# EAGLE board ControlBoard (EAGLE 9.0.1)
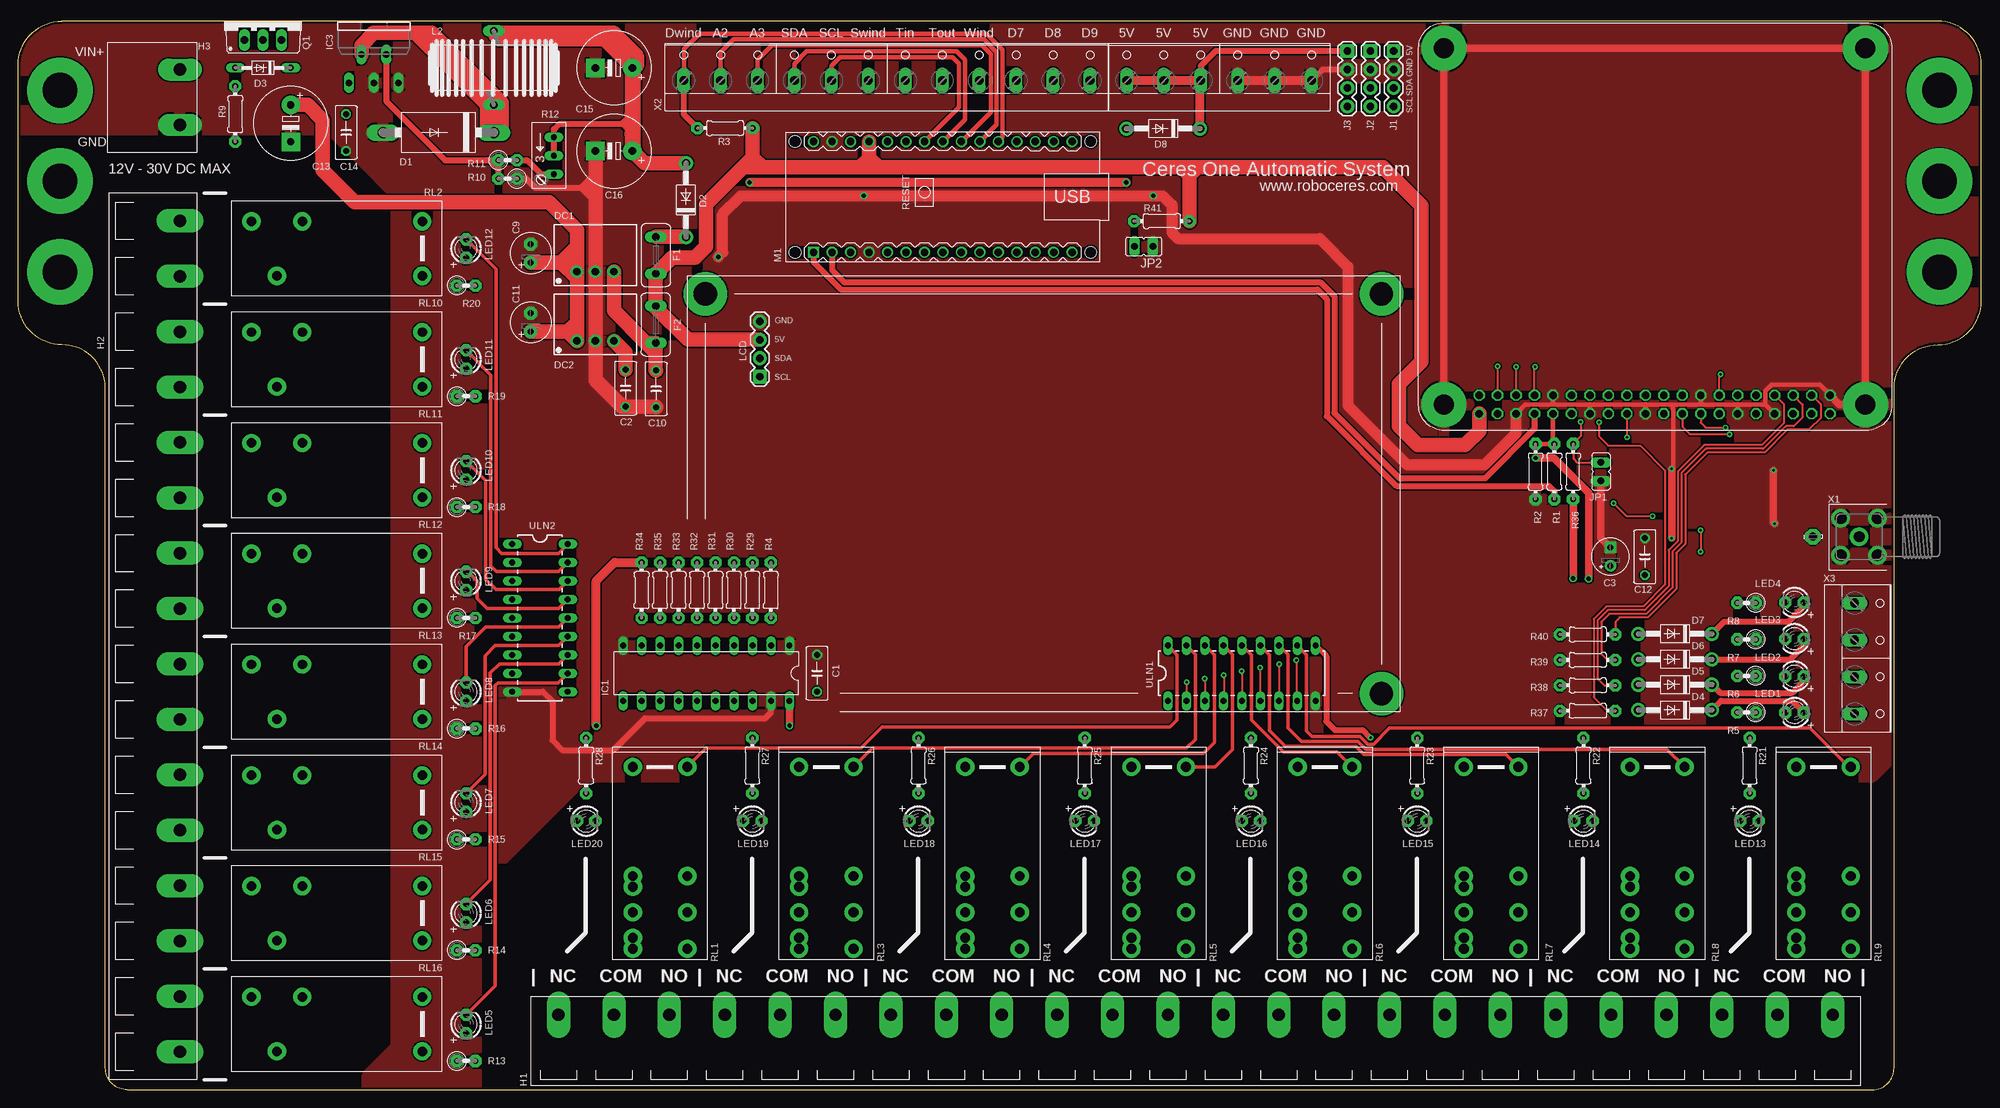
[diagram p1: board, top side]
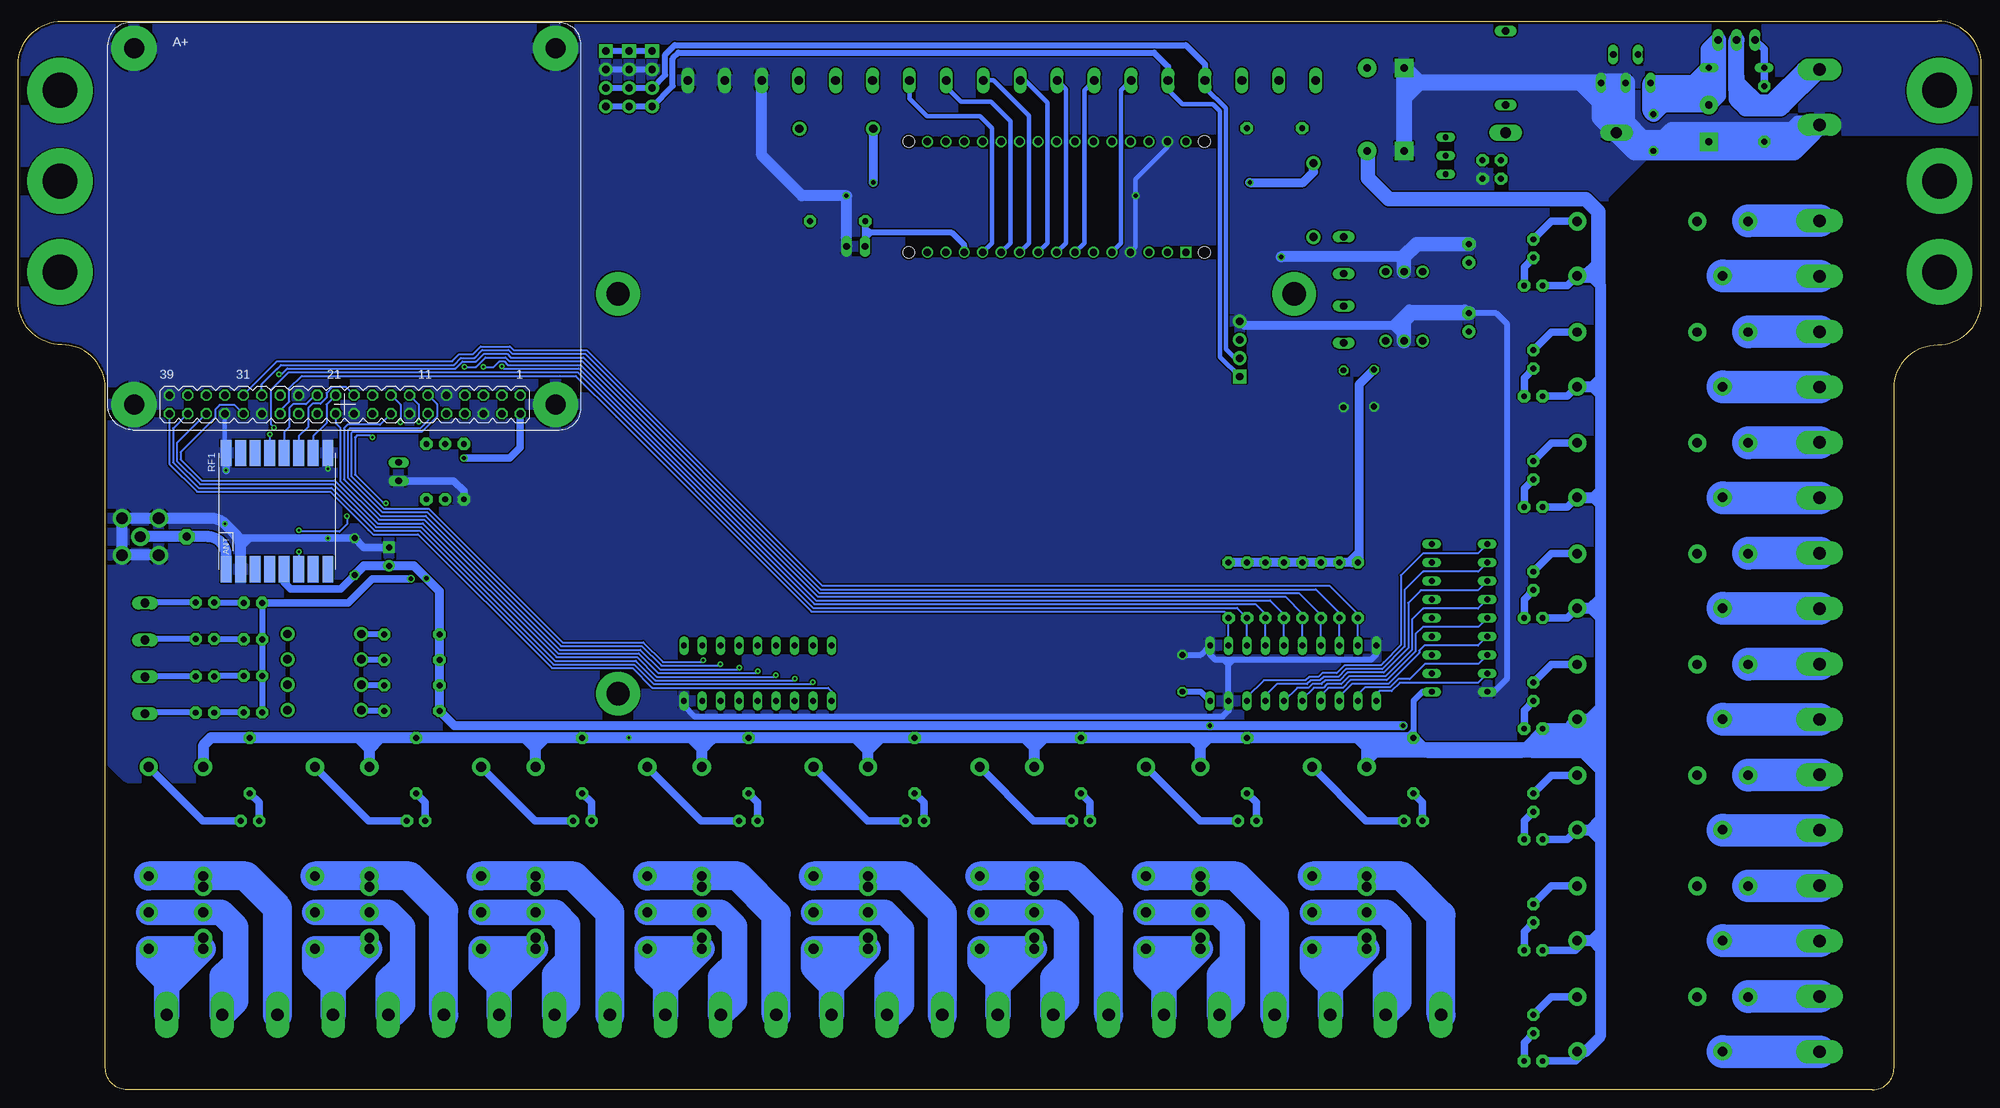
[diagram p2: board, bottom side, seen from below]

Size 270 x 147 mm. Coordinates in mm from the lower left corner, seen from the top.
Outline: 15,0 255,0 arc90 258,3 258,96.5 arc-90 264,102.5 arc90 270,108.5 270,141 arc90 264,147 6,147 arc90 0,141 0,108.5 arc90 6,102.5 arc-90 12,96.5 12,3 arc90 15,0
Copper layers (1*16): Top 0.035mm / dielectric 1.5mm / Bottom 0.035mm
Design rules "default *": minimum track width 6mil, minimum drill 0.35mm, track to track 8mil, track to pad 8mil, pad to pad 8mil, via to via 8mil, smd to smd 0mil, copper to edge 10mil, drill to drill 6mil, minimum pad ring 10mil, minimum via ring 8mil, stop-mask expansion 4mil, vias tented up to drill 0mil, thermal gap 10mil

## Footprints (pad centres in the part's own frame; a part is rotated, then mirrored left to right if it is on the bottom)
C050-030X075 = drill 0.813 octagon: 1 -2.54,0; 2 2.54,0
E2,5-5 = drill 0.813 pad 1.6: + -1.27,0 | drill 0.813 pad 1.6 square: - 1.27,0
E2,5-6 = drill 0.813 pad 1.778: + -1.27,0 | drill 0.813 pad 1.778 octagon: - 1.27,0
E5-10,5 = drill 1.016 pad 2.54: + -2.54,0 | drill 1.016 pad 2.54 square: - 2.54,0
DO201-15 = drill 1.499 long: A 7.62,0; C -7.62,0
DO41-10 = drill 1.118 pad 1.93: A 5.08,0; C -5.08,0
DO34Z7 = drill 0.813 long: A 3.81,0; C -3.81,0
SIP3 = drill 1 pad 1.676: 1 -2.54,0; 2 0,0; 3 2.54,0
TE5 = drill 1.016 long: 1 -2.54,0; 2 2.54,0
24/7.62CONN = drill 1.7 pad 3.2 long: 1 -87.63,3.81; 2 -80.01,3.81; 3 -72.39,3.81; 4 -64.77,3.81; 5 -57.15,3.81; 6 -49.53,3.81; 7 -41.91,3.81; 8 -34.29,3.81; 9 -26.67,3.81; 10 -19.05,3.81; 11 -11.43,3.81; 12 -3.81,3.81; 13 3.81,3.81; 14 11.43,3.81; 15 19.05,3.81; 16 26.67,3.81; 17 34.29,3.81; 18 41.91,3.81; 19 49.53,3.81; 20 57.15,3.81; 21 64.77,3.81; 22 72.39,3.81; 23 80.01,3.81; 24 87.63,3.81
16/7.62CONN = drill 1.7 pad 3.2 long: 1 -57.15,3.81; 2 -49.53,3.81; 3 -41.91,3.81; 4 -34.29,3.81; 5 -26.67,3.81; 6 -19.05,3.81; 7 -11.43,3.81; 8 -3.81,3.81; 9 3.81,3.81; 10 11.43,3.81; 11 19.05,3.81; 12 26.67,3.81; 13 34.29,3.81; 14 41.91,3.81; 15 49.53,3.81; 16 57.15,3.81
2/7.62CONN = drill 1.7 pad 3 long: P$1 -3.81,0; P$2 3.81,0
DIL20 = drill 0.813 long: 1 -11.43,-3.81; 2 -8.89,-3.81; 3 -6.35,-3.81; 4 -3.81,-3.81; 5 -1.27,-3.81; 6 1.27,-3.81; 7 3.81,-3.81; 8 6.35,-3.81; 9 8.89,-3.81; 10 11.43,-3.81; 11 11.43,3.81; 12 8.89,3.81; 13 6.35,3.81; 14 3.81,3.81; 15 1.27,3.81; 16 -1.27,3.81; 17 -3.81,3.81; 18 -6.35,3.81; 19 -8.89,3.81; 20 -11.43,3.81
TO220-5 = drill 0.9 long: 1 -3.4,-8.4; 2 -1.7,-4.5; 3 0,-8.4; 4 1.7,-4.5; 5 3.4,-8.4
1X04 = drill 1.016 pad 1.88 square: 1 0,0 | drill 1.016 pad 1.88: 2 2.54,0; 3 5.08,0; 4 7.62,0
JP1 = drill 0.914 long: 1 0,-1.27; 2 0,1.27
SFT830D = drill 1.016 long: 1 -5.08,0; 2 5.08,0
LED3MM = drill 0.813 pad 1.676 octagon: A -1.27,0; K 1.27,0
LSP11 = drill 1.118 pad 2.159 octagon: MP 0,0
ARDUINO-NANO-3.0 = drill 1 square: J1.1 17.78,7.62 | drill 1: J1.2 15.24,7.62; J1.3 12.7,7.62; J1.4 10.16,7.62; J1.5 7.62,7.62; J1.6 5.08,7.62; J1.7 2.54,7.62; J1.8 0,7.62; J1.9 -2.54,7.62; J1.10 -5.08,7.62; J1.11 -7.62,7.62; J1.12 -10.16,7.62; J1.13 -12.7,7.62; J1.14 -15.24,7.62; J1.15 -17.78,7.62; J2.1 17.78,-7.62; J2.2 15.24,-7.62; J2.3 12.7,-7.62; J2.4 10.16,-7.62; J2.5 7.62,-7.62; J2.6 5.08,-7.62; J2.7 2.54,-7.62; J2.8 0,-7.62; J2.9 -2.54,-7.62; J2.10 -5.08,-7.62; J2.11 -7.62,-7.62; J2.12 -10.16,-7.62; J2.13 -12.7,-7.62; J2.14 -15.24,-7.62; J2.15 -17.78,-7.62 | hole 1.651: -20.32,7.62; -20.32,-7.62; 20.32,-7.62; 20.32,7.62
RASPBERRY_PI_B+ = drill 1.016 octagon: 1 8.37,51.23; 2 8.37,53.77; 3 10.91,51.23; 4 10.91,53.77; 5 13.45,51.23; 6 13.45,53.77; 7 15.99,51.23; 8 15.99,53.77; 9 18.53,51.23; 10 18.53,53.77; 11 21.07,51.23; 12 21.07,53.77; 13 23.61,51.23; 14 23.61,53.77; 15 26.15,51.23; 16 26.15,53.77; 17 28.69,51.23; 18 28.69,53.77; 19 31.23,51.23; 20 31.23,53.77; 21 33.77,51.23; 22 33.77,53.77; 23 36.31,51.23; 24 36.31,53.77; 25 38.85,51.23; 26 38.85,53.77; 27 41.39,51.23; 28 41.39,53.77; 29 43.93,51.23; 30 43.93,53.77; 31 46.47,51.23; 32 46.47,53.77; 33 49.01,51.23; 34 49.01,53.77; 35 51.55,51.23; 36 51.55,53.77; 37 54.09,51.23; 38 54.09,53.77; 39 56.63,51.23; 40 56.63,53.77 | drill 2.75 pad 6.2: PE_BL 3.5,3.5; PE_BR 61.5,3.5; PE_TL 3.5,52.5; PE_TR 61.5,52.5
TO220BV = drill 1.016 long: D 0,-2.54; G -2.54,-2.54; S 2.54,-2.54
0204/7 = drill 0.813 pad 1.676 octagon: 1 -3.81,0; 2 3.81,0
0207/2V = drill 0.813 pad 1.676 octagon: 1 -1.27,0; 2 1.27,0
RJ9W = drill 0.813 long: A 2.54,0.635; E -2.54,0.635; S 0,0.635
RADIO_MODULE = smd 3.6 x 1.5: 3V3 8,1; ANT 8,-7; DIO0 8,3; DIO1 8,5; DIO2 8,7; DIO3 8,-3; DIO4 8,-1; DIO5 -8,-5; GND -8,-7; GND1 -8,7; GND2 8,-5; MISO -8,5; MOSI -8,3; NSS -8,-1; RESET -8,-3; SCK -8,1
DOUBLE_RELAY = drill 1.35 pad 2.5: COM1 7.5,3.75; COM2 7.5,-3.75; NC1 2.5,3.75; NC2 2.5,-3.75; NC3 4,-3.75; NO1 12.5,3.75; NO2 12.5,-3.75; NO3 11,-3.75; S+/R- -12.5,-3.75; S-/R+ -12.5,3.75
OMIH-SS-105LM,300 = drill 1.3 pad 2.5: C1 -11.75,3.75; C2 -11.75,-3.75; COM 8.25,3.75; NC 4.75,-3.75; NO 11.75,-3.75
DIL18 = drill 0.813 long: 1 -10.16,-3.81; 2 -7.62,-3.81; 3 -5.08,-3.81; 4 -2.54,-3.81; 5 0,-3.81; 6 2.54,-3.81; 7 5.08,-3.81; 8 7.62,-3.81; 9 10.16,-3.81; 10 10.16,3.81; 11 7.62,3.81; 12 5.08,3.81; 13 2.54,3.81; 14 0,3.81; 15 -2.54,3.81; 16 -5.08,3.81; 17 -7.62,3.81; 18 -10.16,3.81
SMA90_DIP = drill 1.5 pad 2.54: ANTENNA 0,0 | drill 1.6 pad 2.54: GND1 -2.54,2.54; GND2 2.54,2.54; GND3 -2.54,-2.54; GND4 2.54,-2.54
W237-12P = drill 1.194 long: 1 -27.94,-0.635; 2 -22.86,-0.635; 3 -17.78,-0.635; 4 -12.7,-0.635; 5 -7.62,-0.635; 6 -2.54,-0.635; 7 2.54,-0.635; 8 7.62,-0.635; 9 12.7,-0.635; 10 17.78,-0.635; 11 22.86,-0.635; 12 27.94,-0.635
W237-4P = drill 1.194 long: 1 -7.62,-0.635; 2 -2.54,-0.635; 3 2.54,-0.635; 4 7.62,-0.635
W237-6P = drill 1.194 long: 1 -12.7,-0.635; 2 -7.62,-0.635; 3 -2.54,-0.635; 4 2.54,-0.635; 5 7.62,-0.635; 6 12.7,-0.635

## Placement (x,y rotation side)
C1  0.1u  [C050-030X075]  109.87,57.3 90 top
C2  0.1u  [C050-030X075]  83.53,96.51 270 top
C3  4.7u  [E2,5-5]  219,73.34 90 top
C9  22u  [E2,5-6]  70.5,115.08 90 top
C10  0.1u  [C050-030X075]  87.73,96.43 270 top
C11  22u  [E2,5-6]  70.5,105.56 90 top
C12  0.1u  [C050-030X075]  223.73,73.34 90 top
C13  100u/50  [E5-10,5]  37.48,132.96 270 top
C14  0.1u  [C050-030X075]  45.1,131.69 270 top
C15  470u/16  [E5-10,5]  81.93,140.58 180 top
C16  470u/16  [E5-10,5]  81.93,129.15 180 top
D1  1N5822  [DO201-15]  57.8,131.69 180 top
D2  1N4007  [DO41-10]  91.84,122.41 90 top
D3  10V  [DO34Z7]  33.67,140.58 180 top
D4  1N4007  [DO41-10]  227.88,52.23 180 top
D5  1N4007  [DO41-10]  227.88,55.73 180 top
D6  1N4007  [DO41-10]  227.88,59.23 180 top
D7  1N4007  [DO41-10]  227.88,62.73 180 top
D8  1N4007  [DO41-10]  157.48,132.23 180 top
DC1  TSR 1-2450  [SIP3]  79.39,112.55 0 top
DC2  R-78E3.3-0.5  [SIP3]  79.39,103.02 0 top
F1  [TE5]  87.7,114.81 270 top
F2  [TE5]  87.69,105.27 90 top
H1  24X1(0.300)CONN  [24/7.62CONN]  161.94,6.5 0 top
H2  16X1(0.300)CONN  [16/7.62CONN]  18.43,62.38 270 top
H3  2X1(0.300)CONN  [2/7.62CONN]  22.24,136.54 270 top
IC1  74HC540N  [DIL20]  94.63,57.3 180 top
IC3  LM2576T  [TO220-5]  48.91,146.93 0 top
J1  [1X04]  189.16,142.89 270 top
J2  [1X04]  185.99,142.89 270 top
J3  [1X04]  182.81,142.89 270 top
JP1  [JP1]  217.68,85.05 0 top
JP2  [JP1]  154.8,116 90 top
L2  7447070  [SFT830D]  65.42,140.58 90 top
LCD  [1X04]  102,98.11 90 top
LED1  [LED3MM]  244.31,51.88 180 top
LED2  [LED3MM]  244.31,56.88 180 top
LED3  [LED3MM]  244.31,62.03 180 top
LED4  [LED3MM]  244.31,67.03 180 top
LED5  [LED3MM]  61.61,9.04 90 top
LED6  [LED3MM]  61.61,24.28 90 top
LED7  [LED3MM]  61.61,39.52 90 top
LED8  [LED3MM]  61.61,54.76 90 top
LED9  [LED3MM]  61.61,70 90 top
LED10  [LED3MM]  61.61,85.24 90 top
LED11  [LED3MM]  61.61,100.48 90 top
LED12  [LED3MM]  61.61,115.72 90 top
LED13  [LED3MM]  238.14,36.98 0 top
LED14  [LED3MM]  215.28,36.98 0 top
LED15  [LED3MM]  192.42,36.98 0 top
LED16  [LED3MM]  169.56,36.98 0 top
LED17  [LED3MM]  146.7,36.98 0 top
LED18  [LED3MM]  123.84,36.98 0 top
LED19  [LED3MM]  100.98,36.98 0 top
LED20  [LED3MM]  78.12,36.98 0 top
LSP1  LSP11  [LSP11]  246.83,76.1 0 top
M1  ARDUINO-NANO-3.0  [ARDUINO-NANO-3.0]  127.18,122.83 180 top
PCB1  RASPBERRY_PI_B+  [RASPBERRY_PI_B+]  192.57,146.78 180 bottom
Q1  IRF9Z34NPBF  [TO220BV]  33.67,146.93 0 top
R1  [0204/7]  211.28,85.05 270 top
R2  [0204/7]  208.7,85.05 270 top
R3  [0204/7]  97.22,132.3 180 top
R4  [0204/7]  103.52,68.73 90 top
R5  [0207/2V]  237.7,51.93 180 top
R6  [0207/2V]  237.7,56.95 180 top
R7  [0207/2V]  237.7,61.97 180 top
R8  [0207/2V]  237.7,67 180 top
R9  10k  [0204/7]  29.86,134.23 90 top
R10  1k 1%  [0207/2V]  67.33,125.34 180 top
R11  3k 1%  [0207/2V]  67.33,127.88 0 top
R12  1k  [RJ9W]  73.04,128.51 270 top
R13  [0207/2V]  61.61,3.96 0 top
R14  [0207/2V]  61.61,19.2 0 top
R15  [0207/2V]  61.61,34.44 0 top
R16  [0207/2V]  61.61,49.68 0 top
R17  [0207/2V]  61.61,64.92 0 top
R18  [0207/2V]  61.61,80.16 0 top
R19  [0207/2V]  61.61,95.4 0 top
R20  [0207/2V]  61.61,110.64 0 top
R21  [0204/7]  238.14,44.6 270 top
R22  [0204/7]  215.28,44.6 270 top
R23  [0204/7]  192.42,44.6 270 top
R24  [0204/7]  169.56,44.6 270 top
R25  [0204/7]  146.7,44.6 270 top
R26  [0204/7]  123.84,44.6 270 top
R27  [0204/7]  100.98,44.6 270 top
R28  [0204/7]  78.12,44.6 270 top
R29  [0204/7]  100.98,68.73 90 top
R30  [0204/7]  98.44,68.73 90 top
R31  [0204/7]  95.9,68.73 90 top
R32  [0204/7]  93.36,68.73 90 top
R33  [0204/7]  90.82,68.73 90 top
R34  [0204/7]  85.74,68.73 90 top
R35  [0204/7]  88.28,68.73 90 top
R36  [0204/7]  213.86,85.05 270 top
R37  [0204/7]  215.87,52.14 180 top
R38  [0204/7]  215.87,55.64 180 top
R39  [0204/7]  215.87,59.14 180 top
R40  [0204/7]  215.87,62.64 180 top
R41  [0204/7]  157.3,119.5 0 top
RF1  HOPERF_RADIO  [RADIO_MODULE]  234.4,79.6 270 bottom
RL1  G5RLU1EDC5  [DOUBLE_RELAY]  88.28,31.9 270 top
RL2  OMIH-SS-105LM,300  [OMIH-SS-105LM,300]  43.83,115.72 180 top
RL3  G5RLU1EDC5  [DOUBLE_RELAY]  111.14,31.9 270 top
RL4  G5RLU1EDC5  [DOUBLE_RELAY]  134,31.9 270 top
RL5  G5RLU1EDC5  [DOUBLE_RELAY]  156.86,31.9 270 top
RL6  G5RLU1EDC5  [DOUBLE_RELAY]  179.72,31.9 270 top
RL7  G5RLU1EDC5  [DOUBLE_RELAY]  202.58,31.9 270 top
RL8  G5RLU1EDC5  [DOUBLE_RELAY]  225.44,31.9 270 top
RL9  G5RLU1EDC5  [DOUBLE_RELAY]  248.3,31.9 270 top
RL10  OMIH-SS-105LM,300  [OMIH-SS-105LM,300]  43.83,100.48 180 top
RL11  OMIH-SS-105LM,300  [OMIH-SS-105LM,300]  43.83,85.24 180 top
RL12  OMIH-SS-105LM,300  [OMIH-SS-105LM,300]  43.83,70 180 top
RL13  OMIH-SS-105LM,300  [OMIH-SS-105LM,300]  43.83,54.76 180 top
RL14  OMIH-SS-105LM,300  [OMIH-SS-105LM,300]  43.83,39.52 180 top
RL15  OMIH-SS-105LM,300  [OMIH-SS-105LM,300]  43.83,24.28 180 top
RL16  OMIH-SS-105LM,300  [OMIH-SS-105LM,300]  43.83,9.04 180 top
ULN1  ULN2803A  [DIL18]  168.29,57.3 0 top
ULN2  ULN2803A  [DIL18]  71.77,64.92 270 top
X1  [SMA90_DIP]  253.21,76.08 270 top
X2  [W237-12P]  119.47,139.49 0 top
X3  [W237-4P]  253.21,59.34 270 top
X4  [W237-6P]  165.19,139.49 0 top

## Tracks (layer width: path | path; a pad name or v marks a point on that pad's centre or on a via)
5VCC
  Top 0.813: J3.1 164.69,142.89 162.66,140.85 X4.3
  Top 1.27: X4.1 X4.2 X4.3 162.56,138.75 D8.C
  Bottom 0.813: J3.1 J2.1 J1.1
C1
  Bottom 0.305: IC1.2 R4.1 103.52,65.22 104.1,65.8 160.9,65.8 187.7,92.6 187.75,92.65 193.3,98.2 195.5,98.2 231,98.2 232.7,96.5 232.7,94.7 233.96,93.44 PCB1.28
C2  (via drill 0.35)
  Top 0.305: PCB1.26 231.42,91.78 232.1,91.1 v234.8,91.1
  Bottom 0.305: IC1.3 R29.1 102.37,66.31 160.69,66.31 193.09,98.71 195.8,98.71 232.79,98.71 235.2,96.3 235.2,91.5 v234.8,91.1
C3  (via drill 0.35)
  Top 0.305: PCB1.3 203.48,99.48 v203.5,99.5
  Bottom 0.305: IC1.4 98.44,64.5 R30.1 98.44,65.44 99.82,66.82 160.48,66.82 192.88,99.22 203.22,99.22 v203.5,99.5
C4  (via drill 0.35)
  Top 0.305: PCB1.5 206.02,99.42 v206,99.44
  Bottom 0.305: IC1.5 95.9,64.6 R31.1 95.9,65.4 97.82,67.32 160.27,67.32 192.67,99.72 202.69,99.72 203.2,100.23 203.8,100.23 204.6,99.44 v206,99.44
C5  (via drill 0.35)
  Top 0.305: PCB1.7 208.56,99.4 v208.6,99.44
  Bottom 0.305: IC1.6 R32.1 93.36,65.46 95.73,67.83 160.06,67.83 192.46,100.23 202.48,100.23 202.99,100.74 205.74,100.74 207.04,99.44 v208.6,99.44
C6  (via drill 0.35)
  Top 0.305: PCB1.27 233.96,98.26 v234.12,98.42
  Bottom 0.305: IC1.7 90.82,64.5 R33.1 90.82,65.32 93.84,68.34 159.85,68.34 192.25,100.74 202.26,100.74 202.78,101.25 205.95,101.25 207.02,100.18 208.9,100.18 209.86,99.22 233,99.22 233.8,98.42 v234.12,98.42
C7
  Bottom 0.305: IC1.8 R35.1 88.28,65.58 91.55,68.85 159.64,68.85 192.04,101.25 202.06,101.25 202.56,101.76 206.16,101.76 207.23,100.68 209.11,100.68 210.07,99.72 233.83,99.72 234.4,99.15 234.42,99.15 236.5,97.08 PCB1.29
C8
  Bottom 0.305: IC1.9 85.74,64.7 R34.1 85.74,65.44 89.66,69.36 159.43,69.36 191.83,101.76 201.84,101.76 202.35,102.27 206.37,102.27 207.44,101.19 209.32,101.19 210.28,100.23 234.36,100.23 PCB1.31
CON1
  Top 0.61: M1.J2.11 135.4,131.05 135.4,143.1 133.2,145.3 93.7,145.3 91.6,143.2 91.6,138.91 X2.1
  Top 0.813: X2.1 91.53,134.18 R3.2
CON2
  Top 0.61: M1.J2.10 134.59,132.78 134.59,142.76 132.86,144.49 98.39,144.49 96.61,142.72 X2.2
CON3
  Top 0.61: M1.J2.9 133.77,134.5 133.77,142.43 132.53,143.67 103.67,143.67 101.69,141.69 X2.3
CON4
  Top 0.61: M1.J2.8 130.2,133.47 130.2,141.7 129.04,142.86 108.46,142.86 106.78,141.18 X2.4
  Bottom 0.61: LCD.2 102.65,100.65 103.9,101.9 103.9,135 106.78,137.88 X2.4
  Bottom 0.813: J1.3 J2.3 J3.3 181,139.62 181,142.4 179.7,143.7 109.4,143.7 106.78,141.07 X2.4
CON5
  Top 0.61: M1.J2.7 129.39,135.2 129.39,141.16 128.5,142.05 113.05,142.05 111.86,140.85 X2.5
  Bottom 0.61: LCD.1 104.71,100.82 104.71,134.61 105.7,135.6 109.9,135.6 111.86,137.56 X2.5
  Bottom 0.813: J1.4 J2.4 J3.4 179.98,138.1 179.98,141.9 179.2,142.68 113.78,142.68 111.86,140.75 X2.5
CON6
  Bottom 0.61: M1.J1.5 118.3,116.47 118.3,137.49 X2.6
CON7
  Bottom 0.61: M1.J1.7 123.38,116.47 123.38,137.49 X2.7
CON8
  Bottom 0.61: M1.J1.8 125.92,116.47 125.92,137.67 X2.8
CON9
  Bottom 0.61: M1.J1.9 128.46,116.47 128.46,135.76 131.55,138.85 X2.9
CON10
  Bottom 0.61: M1.J1.10 131,116.47 131,134 135.85,138.85 X2.10
CON11
  Bottom 0.61: M1.J1.11 133.54,116.47 133.54,133.24 136.2,135.9 140.3,135.9 142.34,137.94 X2.11
CON12
  Bottom 0.61: M1.J1.12 136.08,116.47 136.08,132.28 137.7,133.9 145,133.9 147.41,136.31 X2.12
CON_L1
  Top 0.813: D7.C 234.63,64.4 243.5,64.4 245.58,66.48 LED4.A
  Bottom 0.813: LED4.A 252.5,67.03 X3.1
CON_L2
  Top 0.813: D6.C 243.73,59.23 245.58,61.08 LED3.A
  Bottom 0.813: LED3.A 252.42,62.03 X3.2
CON_L3
  Top 0.813: D5.C 234.09,54.6 244,54.6 245.58,56.18 LED2.A
  Bottom 0.813: LED2.A 252.49,56.88 X3.3
CON_L4
  Top 0.813: D4.C 234.23,53.5 243.96,53.5 LED1.A
  Bottom 0.813: LED1.A 252.41,51.88 X3.4
DIO0  (via drill 0.35)
  Top 0.305: PCB1.18 221.26,89.79 v221.3,89.75 | v219.42,80.69 221.18,78.93 v224.77,78.93 | v231.4,77 v231.4,74
  Bottom 0.305: v221.3,89.75 221.53,89.98 223.42,89.98 223.67,89.73 223.67,84.61 219.74,80.69 v219.42,80.69 | v224.77,78.93 224.77,77.83 225.8,76.8 231.2,76.8 v231.4,77 | v231.4,74 231.4,72.6 231.6,72.4 231.4,72.2 RF1.DIO0
GND  (via drill 0.35, 0.6)
  Top 0.61: PCB1.6 207.29,94.28 210.9,94.28 | 210.9,94.28 216,94.28 | 216,94.28 223.9,94.28 | 223.9,94.28 227.6,94.28 | 227.6,94.28 231.3,94.28 | 231.3,94.28 236.7,94.28 | PCB1.30 236.5,94.08 236.7,94.28 | PCB1.25 231.42,94.41 231.3,94.28 | PCB1.20 223.8,94.19 223.9,94.28 | PCB1.14 216.18,94.11 216,94.28 | PCB1.9 211.1,94.48 210.9,94.28 | 236.7,94.28 240.31,94.28 | 240.31,94.28 PCB1.34 | 240.31,94.28 240.31,96.11 241.2,97 247.75,97 PCB1.39 | 227.6,94.28 227.6,93.55 227.61,93.54 227.61,85.61 v227.4,85.4
  Top 0.813: R10.1 69.86,125.34 71.1,124.1 77.4,124.1 | C16.- 79.39,128.8 79.39,126.09 77.4,124.1 | 77.4,124.1 79.39,124.1 | 77.4,124.1 79.39,122.11 79.39,122 | J3.2 179.4,140.35 X4.6 | ULN2.9 72.14,54.76 73.5,53.4 73.5,48.1 74.9,46.7 81.8,46.7 86.2,51.1 102.7,51.1 103.52,51.92 IC1.19
  Top 1.016: v227.4,85.4 v227.4,75.88 | v241.4,85.2 241.4,78.04 v241.57,77.87 | JP1.1 217.68,75.93 C3.- | PCB1.39 250.47,94.28 PCB1.PE_TR PCB1.PE_BR PCB1.PE_BL PCB1.PE_TL
  Top 1.27: X4.4 X4.5 X4.6
  Top 1.5: v96.3,114.6 96.9,115.2 96.9,120.5 99.4,123 v116.3,123 v156.1,123 157.4,123 158.7,121.7 158.7,117.9 159.5,117.1 179,117.1 182.9,113.2 182.9,94.1 191,86 201.7,86 206.02,90.32 PCB1.6
  Top 2: 79.39,128.8 79.39,124.1 79.39,122 DC1.2 DC2.2 79.39,97.61 83.03,93.97 C2.2 87.64,93.97 C10.2
  Bottom 0.305: 103.52,53.6 IC1.19
  Bottom 0.61: M1.J1.4 116.3,115.93 v116.3,123 116.3,125.3 111.94,129.66 M1.J2.2 | RF1.GND1 v227.4,85.4 | PCB1.34 241.58,87.78 RF1.GND
  Bottom 0.813: C1.2 107.33,59.84 IC1.1 106.06,59.86 105.36,59.16 104.2,59.16 | J3.2 J2.2 J1.2 | ULN1.9 178.45,52.85 176.94,51.34 104.36,51.34 103.52,52.18 103.52,53.6 | ULN2.9 67.04,54.76 65.2,56.6 65.2,105.3 66.73,106.83 C11.- | IC1.10 83.2,59.91 83.95,59.16 102.9,59.16 | 102.9,59.16 103.7,59.16 | 103.7,59.16 104.2,59.16 | IC1.19 103.52,58.48 | 103.52,58.54 103.52,58.98 103.7,59.16 | 103.52,58.48 104.2,59.16 | 103.52,58.48 103.52,58.54 | 103.52,58.54 102.9,59.16
  Bottom 1.016: C3.- 222.46,74.61 C12.2 v227.4,75.88 238.18,75.88 | 238.18,75.88 239.4,74.66 | 238.18,75.88 239.58,75.88 240.13,76.43 | RF1.GND v241.4,85.2 | JP1.1 210.08,83.78 208.7,82.4 R2.2
  Bottom 1.27: LCD.4 101.47,105.2 80.9,105.2 | 79.39,105.81 80,105.2 80.9,105.2 | 80.9,105.2 79.39,103.69 DC2.2 | 80.9,105.2 78.7,107.4 71.07,107.4 C11.-
  Bottom 1.5: RF1.GND2 239.4,74.66 arc-45 240.13,76.43 v241.57,77.87 arc-45 243.34,78.6 250.62,78.6 arc45 X1.GND3 X1.GND1 X1.GND2 X1.GND4 | 79.39,114.61 v96.29,114.61 v96.3,114.6 | X4.4 167.74,128.53 162.2,123 v156.1,123 156.07,122.97 JP2.1
  Bottom 2: C11.- 78.37,106.83 79.39,105.81 DC2.2 | C9.- 77.64,116.36 79.39,114.61 DC1.2
  Bottom 2.2: 79.39,139 C15.- 77.34,138.53 | 79.39,139 79.39,136.5 | 79.39,136.5 C16.- | 50.3,138.53 55.14,138.53 | 55.14,138.53 77.34,138.53 | 77.36,138.53 78.92,138.53 79.39,139 | 52.31,135.7 55.14,138.53 | 77.34,138.53 77.36,138.53 | 77.36,138.53 79.39,136.5
  Bottom 2.54: H3.P$2 24.17,130.8 30.5,130.8 | 30.5,130.8 37.8,130.8 | 37.8,130.8 43.6,130.8 | 43.6,130.8 45.1,130.8 | 45.1,130.8 46.7,130.8 | 46.7,130.8 49.29,130.8 | 30.5,130.8 30.12,130.42 R9.1 37.42,130.42 | 37.42,130.42 37.8,130.8 | C13.- 37.42,130.42 | C14.2 45.1,130.8 | C14.2 25.82,129.15 H3.P$2 | C14.2 47.64,129.15 49.29,130.8 | H3.P$2 25.07,132.73 25.9,131.9 42.5,131.9 43.6,130.8 | 50.3,138.53 IC3.3 48.91,133.01 46.7,130.8 | 50.3,138.53 IC3.5 52.31,135.7 52.31,133.82 49.29,130.8 | D1.A 50.3,131.81 50.3,138.53
  pour Bottom: 264,52 255,43 249,43 78,43 63,28 63,-2 59,-6 49,-6 48,-5 48,2 52,6 52,123 43,132 -3,132 -7,136 -7,153 -3,157 -1,159 26,159 264,159 278,145 278,66
  pour Top: 259,47 255,43 236,43 78,43 66,31 63,28 63,17 63,-1 58,-6 49,-6 48,-5 48,2 51,5 52,6 52,7 52,123 47,128 43,132 26,132 -4,132 -11,139 -11,154 -7,158 -1,164 129,164 270,164 282,152 282,70
GPIO27  (via drill 0.35)
  Top 0.305: v214.9,91.9 214.9,89.9 R36.1 213.86,86.84 214.38,86.32 JP1.2
  Bottom 0.305: PCB1.13 214.9,94.28 v214.9,91.9
L1
  Top 0.305: PCB1.37 247.9,94.31 247.9,92.4 246.29,90.79 243.33,90.79 240.22,87.68 232.32,87.68 229.28,84.64 229.28,75.1 228.02,73.85 228.02,68.87 224.13,64.98 220.28,64.98 219.68,64.38 R40.1
  Bottom 0.813: R40.1 222.71,62.64 D7.A
L2
  Top 0.305: PCB1.35 245.4,94.28 245.4,92.5 244.2,91.3 243.12,91.3 240.01,88.19 232.11,88.19 228.77,84.85 228.77,75.31 227.52,74.06 227.52,69.08 223.92,65.48 218.82,65.48 217.72,64.38 217.72,59.98 218.56,59.14 R39.1
  Bottom 0.813: R39.1 222.04,59.14 222.2,59.3 222.73,59.3 D6.A
L3
  Top 0.305: PCB1.33 242.8,94.33 242.8,91.7 239.8,88.7 231.9,88.7 228.26,85.06 228.26,75.52 227.01,74.27 227.01,69.29 223.71,65.99 218.61,65.99 217.21,64.59 217.21,56.59 218.16,55.64 R38.1
  Bottom 0.813: R38.1 222.71,55.64 D5.A
L4  (via drill 0.35)
  Top 0.305: v217.4,91.8 217.4,89.9 218.7,88.6 223.1,88.6 226.5,85.2 226.5,69.5 223.5,66.5 218.4,66.5 216.7,64.8 216.7,54 218.56,52.14 R37.1
  Bottom 0.305: PCB1.15 217.4,94.23 v217.4,91.8
  Bottom 0.813: R37.1 222.71,52.14 D4.A
M1
  Bottom 0.305: PCB1.40 249.2,86.1 245.4,82.3 227.1,82.3 221.8,77 221.2,76.4 215,76.4 196.6,58 185.5,58 182.8,55.3 158.6,55.3 158.13,54.83 ULN1.1
M2  (via drill 0.35)
  Top 0.305: v160.7,56.1 160.67,56.07 ULN1.2
  Bottom 0.305: PCB1.38 248.69,90.98 248.69,86.31 245.19,82.81 226.89,82.81 220.99,76.91 214.79,76.91 196.39,58.51 185.29,58.51 182.59,55.81 160.99,55.81 v160.7,56.1
M3  (via drill 0.35)
  Top 0.305: v163.2,56.54 ULN1.3
  Bottom 0.305: PCB1.36 248.18,88.95 248.18,86.52 244.98,83.32 226.68,83.32 220.78,77.42 214.58,77.42 196.18,59.02 185.08,59.02 182.38,56.32 163.43,56.32 v163.2,56.54
M4  (via drill 0.35)
  Top 0.305: v165.8,57.05 165.8,53.54 ULN1.4
  Bottom 0.305: PCB1.32 240.22,94.2 242.3,94.2 242.9,93.6 242.9,92.5 247.68,87.72 247.68,86.73 244.77,83.82 226.47,83.82 220.57,77.92 214.37,77.92 195.97,59.52 184.87,59.52 182.17,56.82 166.03,56.82 v165.8,57.05
M5  (via drill 0.35)
  Top 0.305: v168.3,57.56 ULN1.5
  Bottom 0.305: PCB1.22 226.34,91.74 225.7,91.1 225.7,83.77 220.36,78.43 214.16,78.43 195.76,60.03 184.66,60.03 181.96,57.33 168.53,57.33 v168.3,57.56
M6  (via drill 0.35)
  Top 0.305: v170.8,58.07 170.8,53.52 ULN1.6
  Bottom 0.305: PCB1.16 220.24,91.5 224.7,91.5 225.19,91.01 225.19,83.98 220.15,78.94 213.95,78.94 195.55,60.54 184.45,60.54 181.75,57.84 171.03,57.84 v170.8,58.07
M7  (via drill 0.35)
  Top 0.305: v173.4,58.57 173.4,53.52 ULN1.7
  Bottom 0.305: PCB1.12 213.64,92.06 214.71,90.99 224.41,90.99 224.68,90.72 224.68,84.19 219.94,79.45 213.74,79.45 195.34,61.05 184.24,61.05 181.54,58.35 173.63,58.35 v173.4,58.57
M8  (via drill 0.35)
  Top 0.305: v175.8,59.08 175.8,53.6 ULN1.8
  Bottom 0.305: PCB1.11 212.4,94.31 212.4,92.58 214.5,90.48 224.02,90.48 224.18,90.32 224.18,84.41 219.73,79.96 213.53,79.96 195.13,61.56 184.03,61.56 181.33,58.86 176.03,58.86 v175.8,59.08
MISO
  Bottom 0.305: PCB1.21 227.6,94.3 227.6,91.7 229.4,89.9 RF1.MISO
MOSI
  Bottom 0.305: PCB1.19 224.92,96.67 226.8,96.67 227.6,95.88 227.6,95.2 228.4,94.4 229.5,94.4 230.1,93.8 230.1,91.2 231.4,89.9 RF1.MOSI
N$1
  Bottom 2.54: RL1.NC3 RL1.NC2
  Bottom 3.5: RL1.NC1 RL1.NC2 79.7,29.4
  Bottom 4: H1.1 74.31,24.01 79.7,29.4 RL1.NC1
N$2
  Bottom 2.54: RL1.NO3 RL1.NO2
  Bottom 3.5: 89.5,19.4 RL1.NO1 92.03,16.86 89.55,14.38 | 89.5,19.4 RL1.NO2 89.55,14.38 | 89.55,14.38 89.55,19.35 89.5,19.4 | 89.55,14.38 H1.3
N$3
  Bottom 2.54: RL3.NC3 RL3.NC2
  Bottom 3.5: RL3.NC1 RL3.NC2 102.5,29.4
  Bottom 4: H1.4 97.17,24.07 102.5,29.4 RL3.NC1
N$4
  Bottom 2.54: RL3.NO2 RL3.NO3
  Bottom 3.5: 112.1,19.4 RL3.NO1 114.89,16.86 112.41,14.38 | 112.1,19.4 RL3.NO2 112.41,14.38 | 112.41,14.38 112.41,19.09 112.1,19.4 | 112.41,14.38 H1.6
N$5
  Bottom 2.54: RL4.NC3 RL4.NC2
  Bottom 3.5: RL4.NC1 RL4.NC2 124.7,29.4
  Bottom 4: H1.7 120.03,24.73 124.7,29.4 RL4.NC1
N$6
  Bottom 2.54: RL4.NO3 RL4.NO2
  Bottom 3.5: 134.9,19.4 RL4.NO1 137.75,17.58 135.27,15.1 | 134.9,19.4 RL4.NO2 135.27,14.38 H1.9 135.27,15.1 | 135.27,15.1 135.27,19.03 134.9,19.4
N$7
  Bottom 2.54: RL5.NC3 RL5.NC2
  Bottom 3.5: RL5.NC1 RL5.NC2 147.9,29.4
  Bottom 4: H1.10 142.89,24.39 147.9,29.4 RL5.NC1
N$8
  Bottom 2.54: RL5.NO3 RL5.NO2
  Bottom 3.5: 157.8,19.4 RL5.NO1 160.61,16.86 158.13,14.38 | 157.8,19.4 RL5.NO2 158.13,14.38 | 158.13,14.38 158.13,19.07 157.8,19.4 | 158.13,14.38 H1.12
N$9
  Bottom 2.54: RL6.NC3 RL6.NC2
  Bottom 3.5: RL6.NC1 RL6.NC2 171,29.4
  Bottom 4: H1.13 165.75,24.15 171,29.4 RL6.NC1
N$10
  Bottom 2.54: RL6.NO3 RL6.NO2
  Bottom 3.5: 180.7,19.4 RL6.NO1 183.47,16.98 180.99,14.5 | 180.7,19.4 RL6.NO2 180.99,14.38 H1.15 180.99,14.5 | 180.99,14.5 180.99,19.11 180.7,19.4
N$11
  Bottom 2.54: RL7.NC3 RL7.NC2
  Bottom 3.5: RL7.NC1 RL7.NC2 193.6,29.4
  Bottom 4: H1.16 188.61,24.41 193.6,29.4 RL7.NC1
N$12
  Bottom 2.54: RL7.NO3 RL7.NO2
  Bottom 3.5: 203.2,19.4 RL7.NO1 206.33,16.86 203.85,14.38 | 203.2,19.4 RL7.NO2 203.85,14.38 | 203.85,14.38 203.85,18.75 203.2,19.4 | 203.85,14.38 H1.18
N$13
  Bottom 2.54: RL8.NC3 RL8.NC2
  Bottom 3.5: RL8.NC1 RL8.NC2 216.2,29.4
  Bottom 4: H1.19 211.47,24.67 216.2,29.4 RL8.NC1
N$14
  Bottom 2.54: RL8.NO3 RL8.NO2
  Bottom 3.5: 226.7,19.4 RL8.NO1 229.19,16.86 226.71,14.38 | 226.7,19.4 RL8.NO2 226.71,14.38 | 226.71,14.38 226.71,19.39 226.7,19.4 | 226.71,14.38 H1.21
N$15
  Bottom 2.54: RL9.NC3 RL9.NC2
  Bottom 3.5: RL9.NC1 RL9.NC2 238.7,29.4
  Bottom 4: H1.22 234.33,25.03 238.7,29.4 RL9.NC1
N$16
  Bottom 2.54: RL9.NO3 RL9.NO2
  Bottom 3.5: 249.6,19.4 RL9.NO1 252.05,17.48 249.57,15 | 249.6,19.4 RL9.NO2 249.57,14.38 H1.24 249.57,15 | 249.57,15 249.57,19.37 249.6,19.4
N$17
  Bottom 3.5: RL1.COM1 RL1.COM2 81.8,24.4 80.1,22.7 80.1,17.5 | 81.93,13.47 H1.2 80.1,12.14 80.1,15.3 | 81.93,13.47 80.1,15.3 | 80.1,15.3 80.1,17.5 | 81.93,13.47 81.93,15.67 80.1,17.5
N$18
  Bottom 3.5: RL3.COM1 RL3.COM2 104.9,24.4 103,22.5 103,16.6 | 104.79,13.81 H1.5 103,12.1 103,15.6 | 104.79,13.81 103,15.6 | 104.79,13.81 104.79,15.81 103.5,17.1 103,16.6 | 103,16.6 103,15.6
N$19
  Bottom 3.5: RL4.COM1 RL4.COM2 127.4,24.4 125.8,22.8 125.8,17.3 | H1.8 127.65,13.35 125.8,15.2 | 125.8,15.2 125.8,17.3 | 125.8,15.2 125.8,12.16 H1.8 | H1.8 127.65,15.45 125.8,17.3
N$20
  Bottom 3.5: RL5.COM1 RL5.COM2 150.8,24.4 148.5,22.1 148.5,17.1 | H1.11 150.51,13.09 148.5,15.1 | 148.5,15.1 148.5,17.1 | 148.5,15.1 148.5,11.7 149.89,10.31 H1.11 | H1.11 150.51,15.19 148.6,17.1 148.5,17.1
N$21
  Bottom 3.5: RL6.COM1 RL6.COM2 173.4,24.4 171.5,22.5 171.5,17.4 | 173.37,13.73 H1.14 171.5,12.18 171.5,15.6 | 173.37,13.73 171.5,15.6 | 171.5,15.6 171.5,17.4 | 173.37,13.73 173.37,15.53 171.5,17.4
N$22
  Bottom 3.5: RL7.COM1 RL7.COM2 196.1,24.4 194.4,22.7 194.4,17.4 | H1.17 196.23,13.77 194.4,15.6 | 194.4,15.6 194.4,17.4 | 194.4,15.6 194.4,11.9 195.99,10.31 H1.17 | H1.17 196.23,15.87 194.7,17.4 194.4,17.4
N$23
  Bottom 3.5: RL8.COM1 RL8.COM2 219.1,24.4 217.1,22.4 217.1,15.7 | 219.09,13.41 H1.20 218.49,10.31 217.1,11.7 217.1,15.4 | 219.09,13.41 217.1,15.4 | 219.09,13.41 219.09,15.11 217.8,16.4 217.1,15.7 | 217.1,15.7 217.1,15.4
N$24
  Bottom 3.5: RL9.COM1 RL9.COM2 242.1,24.4 240.1,22.4 240.1,15.7 | H1.23 241.95,13.65 240.1,15.5 | 240.1,15.5 240.1,12.16 H1.23 | H1.23 241.95,15.65 241,16.6 240.1,15.7 | 240.1,15.7 240.1,15.5
N$25
  Bottom 4.5: H2.2 35.52,111.91 RL2.COM
N$26
  Bottom 4.5: H2.4 35.52,96.67 RL10.COM
N$27
  Bottom 4.5: H2.6 35.52,81.43 RL11.COM
N$28
  Bottom 4.5: H2.8 35.52,66.19 RL12.COM
N$29
  Bottom 4.5: H2.10 35.52,50.95 RL13.COM
N$30
  Bottom 4.5: H2.12 35.52,35.71 RL14.COM
N$31
  Bottom 4.5: H2.14 35.52,20.47 RL15.COM
N$32
  Bottom 4.5: H2.16 35.52,5.23 RL16.COM
N$33
  Bottom 4.5: H2.1 32.02,119.53 RL2.NO
N$34
  Bottom 4.5: H2.3 32.02,104.29 RL10.NO
N$35
  Bottom 4.5: H2.5 32.02,89.05 RL11.NO
N$36
  Bottom 4.5: H2.7 32.02,73.81 RL12.NO
N$37
  Bottom 4.5: H2.9 32.02,58.57 RL13.NO
N$38
  Bottom 4.5: H2.11 32.02,43.33 RL14.NO
N$39
  Bottom 4.5: H2.13 32.02,28.09 RL15.NO
N$40
  Bottom 4.5: H2.15 32.02,12.85 RL16.NO
N$41
  Top 0.508: ULN1.11 177.2,59.82 177.2,49.4 177.97,48.63 184.56,48.63 185.64,47.55 186.36,47.55 188.61,49.8 246.4,49.8 251.8,44.4 RL9.S-/R+
  Bottom 1.016: LED13.K 244.63,36.98 RL9.S-/R+
N$42
  Top 0.508: ULN1.12 174.6,59.88 174.6,49.8 176.48,47.92 184.26,47.92 185.35,46.84 226.75,46.84 RL8.S-/R+
  Bottom 1.016: LED14.K 221.77,36.98 RL8.S-/R+
N$43
  Top 0.508: ULN1.13 172.1,59.84 172.1,49.41 174.29,47.21 183.97,47.21 185.05,46.12 204.61,46.12 RL7.S-/R+
  Bottom 1.016: LED15.K 198.91,36.98 RL7.S-/R+
N$44
  Top 0.508: ULN1.14 169.6,59.8 169.6,50.9 174,46.5 181.37,46.5 RL6.S-/R+
  Bottom 1.016: LED16.K 176.05,36.98 RL6.S-/R+
N$45
  Top 0.508: ULN1.15 167,59.86 167,46.8 164.6,44.4 RL5.S-/R+
  Bottom 1.016: LED17.K 153.19,36.98 RL5.S-/R+
N$46
  Top 0.508: ULN1.16 164.5,59.82 164.5,47.8 163,46.3 139.65,46.3 RL4.S-/R+
  Bottom 1.016: LED18.K 130.33,36.98 RL4.S-/R+
N$47
  Top 0.508: ULN1.17 161.9,59.88 161.9,48.2 160.71,47.01 117.5,47.01 RL3.S-/R+
  Bottom 1.016: LED19.K 107.47,36.98 RL3.S-/R+
N$48
  Top 0.508: ULN1.18 159.4,59.84 159.4,50.9 158.4,49.9 118.8,49.9 115.9,47 94.63,47 RL1.S-/R+
  Bottom 1.016: LED20.K 84.61,36.98 RL1.S-/R+
N$49
  Top 0.508: ULN2.18 74.3,73.8 66.5,73.8 65.72,74.58 65.72,112.88 LED12.K
  Bottom 1.016: RL2.C2 59.13,119.47 LED12.K
N$50
  Top 0.508: ULN2.17 74.34,71.3 65.8,71.3 65.01,72.09 65.01,98.35 LED11.K
  Bottom 1.016: RL10.C2 59.13,104.23 LED11.K
N$51
  Top 0.508: ULN2.16 74.38,68.8 65.7,68.8 64.3,70.2 64.3,83.82 LED10.K
  Bottom 1.016: RL11.C2 59.13,88.99 LED10.K
N$52
  Top 0.508: ULN2.15 74.32,66.2 64.5,66.2 63.1,67.6 63.1,70 61.83,71.27 LED9.K
  Bottom 1.016: RL12.C2 59.13,73.75 LED9.K
N$53
  Top 0.508: ULN2.14 74.36,63.7 64.3,63.7 61.61,61.01 LED8.K
  Bottom 1.016: RL13.C2 59.13,58.51 LED8.K
N$54
  Top 0.508: ULN2.13 74.3,61.1 65.6,61.1 64.2,59.7 64.2,43.38 LED7.K
  Bottom 1.016: RL14.C2 59.13,43.27 LED7.K
N$55
  Top 0.508: ULN2.12 74.34,58.6 66.2,58.6 64.91,57.31 64.91,28.85 LED6.K
  Bottom 1.016: RL15.C2 59.13,28.03 LED6.K
N$56
  Top 0.508: ULN2.11 74.28,56 66,56 65.62,55.62 65.62,14.32 LED5.K
  Bottom 1.016: RL16.C2 59.13,12.79 LED5.K
N$57
  Bottom 0.305: ULN2.8 69.26,56 79.97,56 81.13,54.84 82.76,54.84 83.3,54.3 83.2,54.2 IC1.11
N$58
  Bottom 0.305: ULN2.7 69.2,58.6 76.5,58.6 78.59,56.51 80.18,56.51 81.34,55.35 84.75,55.35 85.74,54.36 IC1.12
N$59
  Bottom 0.305: ULN2.6 69.24,61.1 76.6,61.1 77.29,60.41 77.29,60.12 81.55,55.86 86.54,55.86 88.28,54.12 IC1.13
N$60
  Bottom 0.305: ULN2.5 69.18,63.7 76.8,63.7 77.8,62.7 77.8,60.33 81.76,56.37 86.75,56.37 87.82,55.3 89.8,55.3 91.1,54 90.82,53.72 IC1.14
N$61
  Bottom 0.305: ULN2.4 69.22,66.2 76.8,66.2 78.31,64.69 78.31,60.54 81.97,56.88 86.96,56.88 88.03,55.81 90.01,55.81 90.52,55.3 91.8,55.3 93.36,53.74 IC1.15
N$62
  Bottom 0.305: ULN2.3 69.26,68.7 77.1,68.7 78.82,66.98 78.82,60.75 82.18,57.38 87.17,57.38 88.24,56.32 90.22,56.32 90.73,55.81 92.01,55.81 92.52,55.3 94.09,55.3 IC1.16
N$63
  Bottom 0.305: ULN2.2 69.2,71.3 76.8,71.3 79.32,68.78 79.32,60.96 82.39,57.89 87.38,57.89 88.45,56.82 90.43,56.82 90.94,56.32 92.22,56.32 92.73,55.81 96.89,55.81 98.44,54.26 IC1.17
N$64
  Bottom 0.305: ULN2.1 69.24,73.8 76.8,73.8 79.83,70.77 79.83,61.17 82.2,58.8 82.6,58.4 87.59,58.4 88.66,57.33 90.64,57.33 91.15,56.82 92.43,56.82 92.94,56.32 98.68,56.32 100.98,54.02 IC1.18
N$65
  Bottom 1.5: RF1.ANT 241.4,73.56 arc-45 242.13,75.33 242.16,75.36 arc-45 243.93,76.1 LSP1.MP 253.19,76.1 X1.ANTENNA
N$66
  Top 0.813: M1.J1.1 109.4,113.86 113.18,110.08 178.68,110.08 179.98,108.78 179.98,92.68 189.58,83.08 210.52,83.08 211.28,82.32 R1.2
N$67
  Bottom 0.813: R5.1 242.99,51.93 LED1.K
N$68
  Bottom 0.813: R6.1 242.97,56.95 LED2.K
N$69
  Bottom 0.813: R7.1 242.98,61.97 LED3.K
N$70
  Bottom 1.016: Q1.G 29.86,143.12 D3.A R9.2
N$71  (via drill 4.8 pad 9)
  other vias: 264.25,112.5
N$72
  Top 0.813: IC3.4 50.61,135.99 58.72,127.88 64.5,127.88 64.78,127.88 | 64.78,127.88 R11.1 66.06,126.6 | R10.2 66.06,126.6 | 66.06,126.6 64.78,127.88
N$73
  Bottom 0.813: R8.1 243.01,67 LED4.K
N$74
  Bottom 1.27: 28.45,136.25 32.45,136.25 32.6,136.4 | 33.67,139.3 29.67,135.3 29.4,135.3
  Bottom 2.2: 27.29,135.3 H3.P$1 24.35,140.35 28.45,136.25 29.4,135.3 | 33.67,137.47 33.67,139.3 Q1.D | 27.29,135.3 29.4,135.3 | 29.4,135.3 31.5,135.3 32.6,136.4 33.67,137.47 | 33.67,137.47 33.67,136.27 32.4,135 27.59,135 27.29,135.3
N$75
  Top 2: F1.1 91.81,117.35 D2.C
N$76
  Top 2: DC1.3 81.93,107.17 86.37,102.73 | 86.37,102.73 F2.1 87.69,101.41 | C10.1 87.69,99 87.69,101.41 | 86.37,102.73 87.69,101.41
N$77
  Top 2: IC3.2 47.21,143.71 48.92,145.42 53.1,145.42 54.58,145.42 | 65.42,136.88 L2.1 D1.C | 54.58,145.42 56.88,145.42 65.42,136.88 | D1.C 65.01,131.69 64.5,132.2 64.5,135.5 54.58,145.42 | 65.42,136.88 66.5,135.8 66.5,132.5 65.69,131.69 D1.C
N$78
  Top 0.813: R11.2 70.02,127.88 71.92,125.97 R12.A
N$79
  Bottom 1.016: LED5.A 62.88,6.5 R13.2
N$80
  Bottom 1.016: LED6.A 62.88,21.74 R14.2
N$81
  Bottom 1.016: LED7.A 62.88,36.98 R15.2
N$82
  Bottom 1.016: LED8.A 62.88,52.22 R16.2
N$83
  Bottom 1.016: LED9.A 62.88,67.46 R17.2
N$84
  Bottom 1.016: LED10.A 62.88,82.7 R18.2
N$85
  Bottom 1.016: LED11.A 62.88,97.94 R19.2
N$86
  Bottom 1.016: LED12.A 62.88,113.18 R20.2
N$87
  Bottom 1.016: LED13.A 236.87,39.52 R21.2
N$88
  Bottom 1.016: LED14.A 214.01,39.52 R22.2
N$89
  Bottom 1.016: LED15.A 191.15,39.52 R23.2
N$90
  Bottom 1.016: LED16.A 168.29,39.52 R24.2
N$91
  Bottom 1.016: LED17.A 145.43,39.52 R25.2
N$92
  Bottom 1.016: LED18.A 122.57,39.52 R26.2
N$93
  Bottom 1.016: LED19.A 99.71,39.52 R27.2
N$94
  Bottom 1.016: LED20.A 76.85,39.52 R28.2
N$95  (via drill 4.8 pad 9)
  other vias: 264.25,125
N$96  (via drill 4.8 pad 9)
  other vias: 264.25,137.5
N$97  (via drill 4.8 pad 9)
  other vias: 5.75,112.5
N$98  (via drill 4.8 pad 9)
  other vias: 5.75,125
N$99  (via drill 4.8 pad 9)
  other vias: 5.75,137.5
N$100  (via drill 3.2 pad 6)
  other vias: 94.5,109.5
N$101  (via drill 3.2 pad 6)
  other vias: 187.5,109.5
N$102  (via drill 3.2 pad 6)
  other vias: 187.5,54.5
N$103
  Bottom 0.813: JP2.2 153.53,116.5 153.53,117.17 | 153.53,117.17 153.53,117.9 | 153.53,117.9 153.53,118.63 | R41.1 153.53,119.46 153.53,118.63 | M1.J1.13 139.88,116.18 141.6,117.9 152.8,117.9 | 152.8,117.9 153.53,117.9 | 152.8,117.9 153.53,118.63 | 152.8,117.9 153.53,117.17
PP3V3  (via drill 0.6)
  Top 1.016: IC1.20 106.06,50.14 v106.1,50.1 | R36.2 v213.86,70.36 v213.85,70.35
  Top 1.27: v79.5,50.1 79.5,70 82.04,72.54 R34.2
  Top 2: DC2.3 83.53,101.42 C2.1
  Bottom 0.813: IC1.20 107.33,54.76 C1.1 | R35.2 86.7,72.54
  Bottom 1.016: RF1.3V3 233.4,69.8 232.5,68.9 225.63,68.9 C12.1
  Bottom 1.27: C12.1 222.46,72.07 C3.+ 215.57,72.07 v213.85,70.35 212.06,68.56 R40.2 R39.2 R38.2 R37.2 210.02,50.1 v106.1,50.1 v79.5,50.1 | C2.1 85.6,96.98 85.6,73.9 | R34.2 85.6,72.68 85.6,73.9 | 86.7,72.54 R34.2 | R34.2 R35.2 | R35.2 R33.2 R32.2 R31.2 R30.2 R29.2 R4.2 | 85.6,73.9 86.96,72.54 R35.2
PP5V0  (via drill 0.6)
  Top 1.016: v216,70.3 216,82.1 211.2,86.9 v208.7,86.9
  Top 2: PCB1.2 200.94,90.64 199,88.7 192.5,88.7 189.9,91.3 189.9,97.1 193,100.2 193,121.6 187.7,126.9 162.21,126.9 | 99.7,126.9 94.6,121.8 94.6,116 93.1,114.5 89.93,114.5 F1.2 87.69,112.26 F2.2 87.69,107.61 92.11,103.19 LCD.3 | 99.7,126.9 102.36,126.9 | 102.36,126.9 115.8,126.9 | 115.8,126.9 117.2,126.9 | 117.2,126.9 118.3,126.9 | 118.3,126.9 160.01,126.9 | 160.01,126.9 161.2,126.9 | 161.2,126.9 162.21,126.9 | R41.2 161.11,125.8 | 161.11,125.8 161.11,126.81 161.2,126.9 | R3.1 101.03,128.23 | 101.03,128.23 99.7,126.9 | 101.03,128.23 102.36,126.9 | 161.11,125.8 160.01,126.9 | 161.11,125.8 162.21,126.9 | M1.J2.4 117.02,128.12 | 117.02,128.12 117.02,127.08 117.2,126.9 | 117.02,128.12 115.8,126.9 | 117.02,128.12 117.08,128.12 118.3,126.9
  Bottom 0.813: R8.2 R7.2 R6.2 R5.2
  Bottom 1.016: R8.2 224.6,67 221.3,70.3 v216,70.3 | v208.7,86.9 202.4,86.9 200.94,88.36 PCB1.2
PP5V5  (via drill 0.35, 0.6)
  Top 0.813: R12.S R12.E 73.67,132.18 74.4,132.9 83.07,132.9 | 84.47,133.1 84.27,132.9 83.07,132.9 | 83.07,132.9 84.47,131.5 | 83.07,132.9 84.37,134.2 84.47,134.2 | ULN1.10 179.9,59.66 179.9,50.7 181.1,49.5 184.91,49.5 v186,48.41
  Top 1.27: v152.4,124.8 v100.6,124.8
  Top 1.5: L2.2 80.64,145.66 | C15.+ 84.47,141.83 80.64,145.66 | L2.2 66.78,144.3 | C15.+ 84.22,140.58 80.5,144.3 66.78,144.3 | L2.2 65.42,144.98 66.1,144.3 66.78,144.3 | 80.64,145.66 81.94,145.66 85.3,142.3 85.3,140.8 85.08,140.58 C15.+
  Top 2: C16.+ 86.13,127.49 D2.A
  Top 2.2: C15.+ 84.47,134.2 84.47,133.1 84.47,131.5 C16.+
  Bottom 0.813: ULN2.10 76.84,54.76 78.1,53.5 78.1,49.4 | R28.1 78.1,48.43 78.1,49.4 | 78.1,49.4 79.09,48.41 79.4,48.41
  Bottom 1.016: R13.1 55.74,3.96 54.41,5.29 | R14.1 55.83,19.2 54.5,20.53 | R15.1 56.91,34.44 RL14.C1 | 58.4,49.68 56.91,49.68 56.49,50.09 | R17.1 56.91,64.92 RL12.C1 | R18.1 56.91,80.16 RL11.C1 | R19.1 56.91,95.4 RL10.C1 | R20.1 56.91,110.64 RL2.C1
  Bottom 1.27: D8.A v152.4,124.8 | v100.6,124.8 93.3,124.8 91.84,126.26 D2.A
  Bottom 1.5: R28.1 79.4,48.41 83,48.41 | 83,48.41 84.5,48.41 | 84.5,48.41 85.84,48.41 | 85.84,48.41 R27.1 106.28,48.41 | 106.28,48.41 107.4,48.41 | 107.4,48.41 108.5,48.41 | 108.5,48.41 R26.1 128.94,48.41 | 128.94,48.41 130.3,48.41 | 130.3,48.41 131.56,48.41 | 131.56,48.41 R25.1 151.6,48.41 | 151.6,48.41 153.2,48.41 | 153.2,48.41 154.82,48.41 | 154.82,48.41 R24.1 174.7,48.41 | 174.7,48.41 175.8,48.41 | 175.8,48.41 177.48,48.41 | 177.48,48.41 v186,48.41 R23.1 197.6,48.41 | 197.6,48.41 198.4,48.41 | 198.4,48.41 200.3,48.41 | 200.3,48.41 R22.1 220.2,48.41 | 220.2,48.41 221.4,48.41 | 221.4,48.41 223.18,48.41 | 223.18,48.41 R21.1 243.49,48.41 244.55,47.35 RL9.S+/R- | RL1.S+/R- 84.53,45.3 | 84.53,45.3 84.53,47.1 | 84.53,47.1 84.53,48.38 84.5,48.41 | RL3.S+/R- 107.39,47.3 | 107.39,47.3 107.39,48.4 107.4,48.41 | RL4.S+/R- 130.25,47.1 | 130.25,47.1 130.25,48.36 130.3,48.41 | RL5.S+/R- 153.11,46.7 | 153.11,46.7 153.11,48.32 153.2,48.41 | RL6.S+/R- 175.97,46.9 | 175.97,46.9 175.97,48.24 175.8,48.41 | RL7.S+/R- 198.83,47.1 | 198.83,47.1 198.83,47.98 198.4,48.41 | RL8.S+/R- 221.69,46.92 | 221.69,46.92 221.69,48.12 221.4,48.41 | 84.53,47.1 85.84,48.41 | 84.53,47.1 84.31,47.1 | 84.31,47.1 83,48.41 | 107.39,47.3 106.28,48.41 | 107.39,47.3 108.5,48.41 | 130.25,47.1 128.94,48.41 | 130.25,47.1 131.56,48.41 | 153.11,46.7 151.6,48.21 151.6,48.41 | 153.11,46.7 154.82,48.41 | 175.97,46.9 174.7,48.17 174.7,48.41 | 175.97,46.9 177.48,48.41 | 198.83,47.1 197.6,48.33 197.6,48.41 | 198.83,47.1 198.99,47.1 200.3,48.41 | 221.69,46.92 220.2,48.41 | 221.69,46.92 223.18,48.41 | 52.4,110.7 53.67,111.97 RL2.C1 54.53,111.97 52.7,113.8 | 52.4,110.7 52.4,97.76 | 52.4,97.76 52.4,96.8 | 52.4,96.8 52.4,95.7
  Bottom 1.5: 52.4,95.7 52.4,82.39 | 52.4,82.39 52.4,81.6 | 52.4,81.6 52.4,80.59 | 52.4,80.59 52.4,67.55 | 52.4,67.55 52.4,66 | 52.4,66 52.4,64.95 | 52.4,64.95 52.4,52.51 | 52.4,52.51 52.4,51.2 | 52.4,51.2 52.4,49.9 | 52.4,49.9 52.4,47.7 | 52.4,47.7 52.4,46.4 | 52.4,46.4 52.4,45.1 | 52.4,45.1 52.4,44 | 52.4,44 52.4,37.17 | 52.4,37.17 52.4,36.2 | 52.4,36.2 52.4,34.4 | 52.4,34.4 52.4,21.66 | 52.4,21.66 52.4,20.6 | 52.4,20.6 52.4,19.4 | 52.4,19.4 52.4,7.3 54.41,5.29 RL16.C1 | RL15.C1 54.5,20.53 53.53,20.53 | 53.53,20.53 52.47,20.53 52.4,20.6 | RL14.C1 53.8,35.77 | 53.8,35.77 52.83,35.77 52.4,36.2 | RL13.C1 53.9,51.01 | 53.9,51.01 52.59,51.01 52.4,51.2 | RL12.C1 53.7,66.25 | 53.7,66.25 52.65,66.25 52.4,66 | RL11.C1 53.3,81.49 | 53.3,81.49 52.51,81.49 52.4,81.6 | 52.4,96.8 52.47,96.73 RL10.C1 53.43,96.73 | 53.53,20.53 52.4,19.4 | 53.53,20.53 52.4,21.66 | 53.8,35.77 52.43,34.4 52.4,34.4 | 53.8,35.77 52.4,37.17 | 53.7,50.81 52.79,49.9 52.4,49.9 | 53.9,51.01 52.4,52.51 | 53.7,66.25 52.4,64.95 | 53.7,66.25 52.4,67.55 | 53.3,81.49 52.4,80.59 | 53.3,81.49 52.4,82.39 | 53.43,96.73 52.4,95.7 | 53.43,96.73 52.4,97.76 | R28.1 76.95,47.24 | 76.95,47.24 76.11,46.4 | 76.11,46.4 63.3,46.4 | 61.68,46.4 60.18,46.4 | 60.18,46.4 58.2,46.4 | 58.2,46.4 56.8,46.4 | 56.8,46.4 55.2,46.4 | 54.8,46.4 53.7,46.4 | 53.7,46.4 52.4,46.4 | 76.11,46.4 83.43,46.4 84.53,45.3 | 76.95,47.24 79.36,47.24 79.5,47.1 84.31,47.1 | 53.7,46.4 52.4,47.7 | 53.7,46.4 52.4,45.1 | 52.4,110.84 52.4,112.5 52.7,112.8 | 53.53,111.97 52.4,110.84 | 52.4,110.84 52.4,110.7 | 53.7,46.4 53.7,47.9 | 53.7,47.9 53.7,49.1 | 53.7,49.13 53.7,50.81 | 53.7,50.81 53.9,51.01 | 55,46.6 53.7,47.9 | 53.7,49.1 53.7,49.13 | 53.7,49.13 RL13.C1 | 53.7,49.1 55.58,50.98 RL13.C1
  Bottom 1.5: RL13.C1 55,50.43 55,46.6 | 55,46.6 55.2,46.4 | RL13.C1 55.58,49.4 | 55.58,49.4 55.58,47.62 56.8,46.4 | 58.2,46.4 56.49,48.1 56.49,50.09 RL13.C1 | 58.4,49.68 R16.1 60.34,49.36 62.65,47.05 | 58.4,49.68 56.9,49.68 | 56.9,49.68 55.86,49.68 55.58,49.4 | 56.9,49.68 60.18,46.4 | 58.4,49.68 61.68,46.4 | 61.68,46.4 63.3,46.4 | 62.65,47.05 63.3,46.4 | 62.65,47.05 76.76,47.05 R28.1 | 55.2,46.4 54.8,46.4 | 54.8,46.4 52.4,44
  Bottom 2: RL2.C1 53.53,111.97 52.7,112.8 52.7,113.8 52.7,120.8 54.4,122.5 81.5,122.5 84.4,125.4 84.4,129.08 C16.+
PP24V
  Top 2: 76.85,105.56 DC2.1 75.58,104.29 | 76.85,111.67 76.85,106.1 76.85,105.56 | 76.85,111.67 DC1.1 76.85,113.9 | 76.85,113.9 76.85,115.97 | 76.85,115.97 76.85,118.25 73,122.1 46.3,122.1 41.9,126.5 41.9,133.4 39.8,135.5 C13.+ | C9.+ 74.7,113.81 | 74.7,113.81 76.77,113.81 76.85,113.9 | 74.7,113.81 76.85,115.97 | 74.7,113.81 76.85,111.67 | C11.+ 75.58,104.29 | 75.58,104.29 76.85,105.56
  Bottom 2.2: 36.21,140.5 Q1.S 37.48,143.12 D3.C | 36.21,140.5 36.21,137.69 | 37.48,136.42 C13.+ | 36.21,137.69 37.48,136.42 | 36.21,140.5 36.29,140.58 D3.C | D3.C 37.48,136.42 | IC3.1 39.53,138.53 | 39.53,138.53 D3.C | 39.53,138.53 38.69,137.69 36.21,137.69 | 39.53,138.53 39.53,138.47 37.48,136.42 | IC3.1 43.38,136.4 37.5,136.4 37.48,136.42 | 36.21,137.69 36.21,136.77 C13.+ | C13.+ 43.83,135.5 C14.1 45.51,134.64 IC3.1
RF_SS  (via drill 0.35)
  Top 0.305: PCB1.24 228.88,91.22 229.9,90.2 v235.4,90.2
  Bottom 0.305: v235.4,90.2 RF1.NSS
RX
  Top 0.813: M1.J1.2 111.94,112.76 113.6,111.1 179.1,111.1 181,109.2 181,93.1 190,84.1 201.72,84.1 208.56,90.94 PCB1.8
SCK
  Bottom 0.305: PCB1.23 229.15,95.56 230.4,94.3 232.2,94.3 232.7,93.8 232.7,91.2 233.4,90.5 RF1.SCK
TX
  Top 0.61: PCB1.10 211.1,89.04 R1.1 210.2,88.86 R2.1

## Text on the board
tPlace: Dwind | A2 | A3 | SDA | SCL | Swind | Tin | Tout | Wind | D7 | D8 | D9 | 5V | 5V | 5V | GND | GND | GND | VIN+ | 5V | GND | SDA | SCL | GND | 12V - 30V DC MAX | Ceres One Automatic System | www.roboceres.com | GND | 5V | SDA | SCL | | | NC | COM | NO | | | | | NC | COM | NO | | | | | NC | COM | NO | | | | | NC | COM | NO | | | | | NC | COM | NO | | | | | NC | COM | NO | | | | | NC | COM | NO | | | | | NC | COM | NO | |